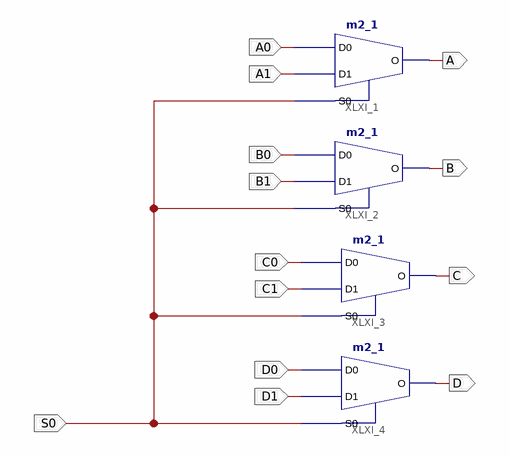
[diagram p0: schematic sheet 1]
// Xilinx ISE schematic mux2_14.sch (spartan6) as structural Verilog: 4 symbols, 13 ports
module mux2_14 (
  input  D1,
  input  D0,
  input  C1,
  input  C0,
  input  B1,
  input  B0,
  input  A1,
  input  A0,
  input  S0,
  output A,
  output B,
  output C,
  output D
);

  m2_1 XLXI_1 (.D0(A0), .D1(A1), .S0(S0), .O(A));
  m2_1 XLXI_2 (.D0(B0), .D1(B1), .S0(S0), .O(B));
  m2_1 XLXI_3 (.D0(C0), .D1(C1), .S0(S0), .O(C));
  m2_1 XLXI_4 (.D0(D0), .D1(D1), .S0(S0), .O(D));
endmodule
